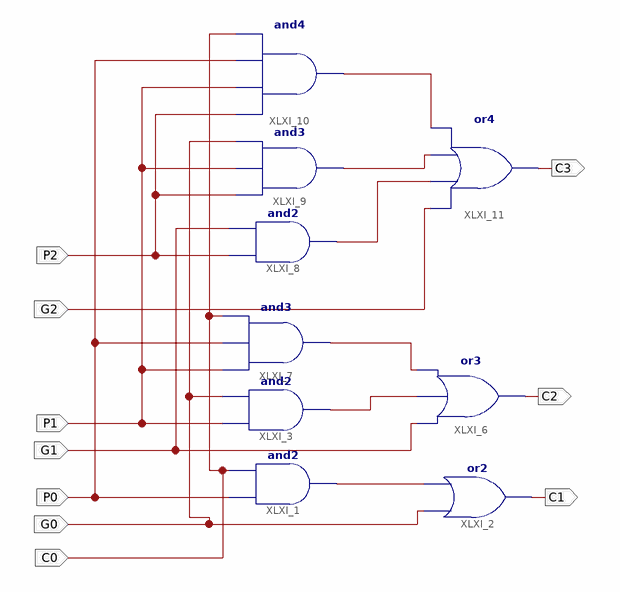
[diagram p0: schematic sheet 1]
// Xilinx ISE schematic CLA.sch (spartan3e) as structural Verilog: 9 symbols, 10 ports
module CLA (
  input  G0,
  input  P0,
  input  C0,
  input  G1,
  input  P1,
  input  G2,
  input  P2,
  output C1,
  output C2,
  output C3
);

  wire XLXN_1, XLXN_10, XLXN_11, XLXN_21, XLXN_22, XLXN_23;

  and XLXI_1 (XLXN_1, P0, C0);
  or XLXI_2 (C1, G0, XLXN_1);
  and XLXI_3 (XLXN_11, P1, G0);
  or XLXI_6 (C2, G1, XLXN_11, XLXN_10);
  and XLXI_7 (XLXN_10, P1, P0, C0);
  and XLXI_8 (XLXN_23, P2, G1);
  and XLXI_9 (XLXN_22, P2, P1, G0);
  and XLXI_10 (XLXN_21, P2, P1, P0, C0);
  or XLXI_11 (C3, G2, XLXN_23, XLXN_22, XLXN_21);
endmodule
